# EasyEDA Pro project ProProject_称重电路的放大_2024-03-14.epro

# Schematic Schematic1
Create Date: 2024-03-13; Page Name: P1; Project Name: 称重电路的放大; Schematic Name: Schematic1; Update Date: 2024-03-14; Company: 嘉立创EDA; Page Size: A4; Version: V1.0
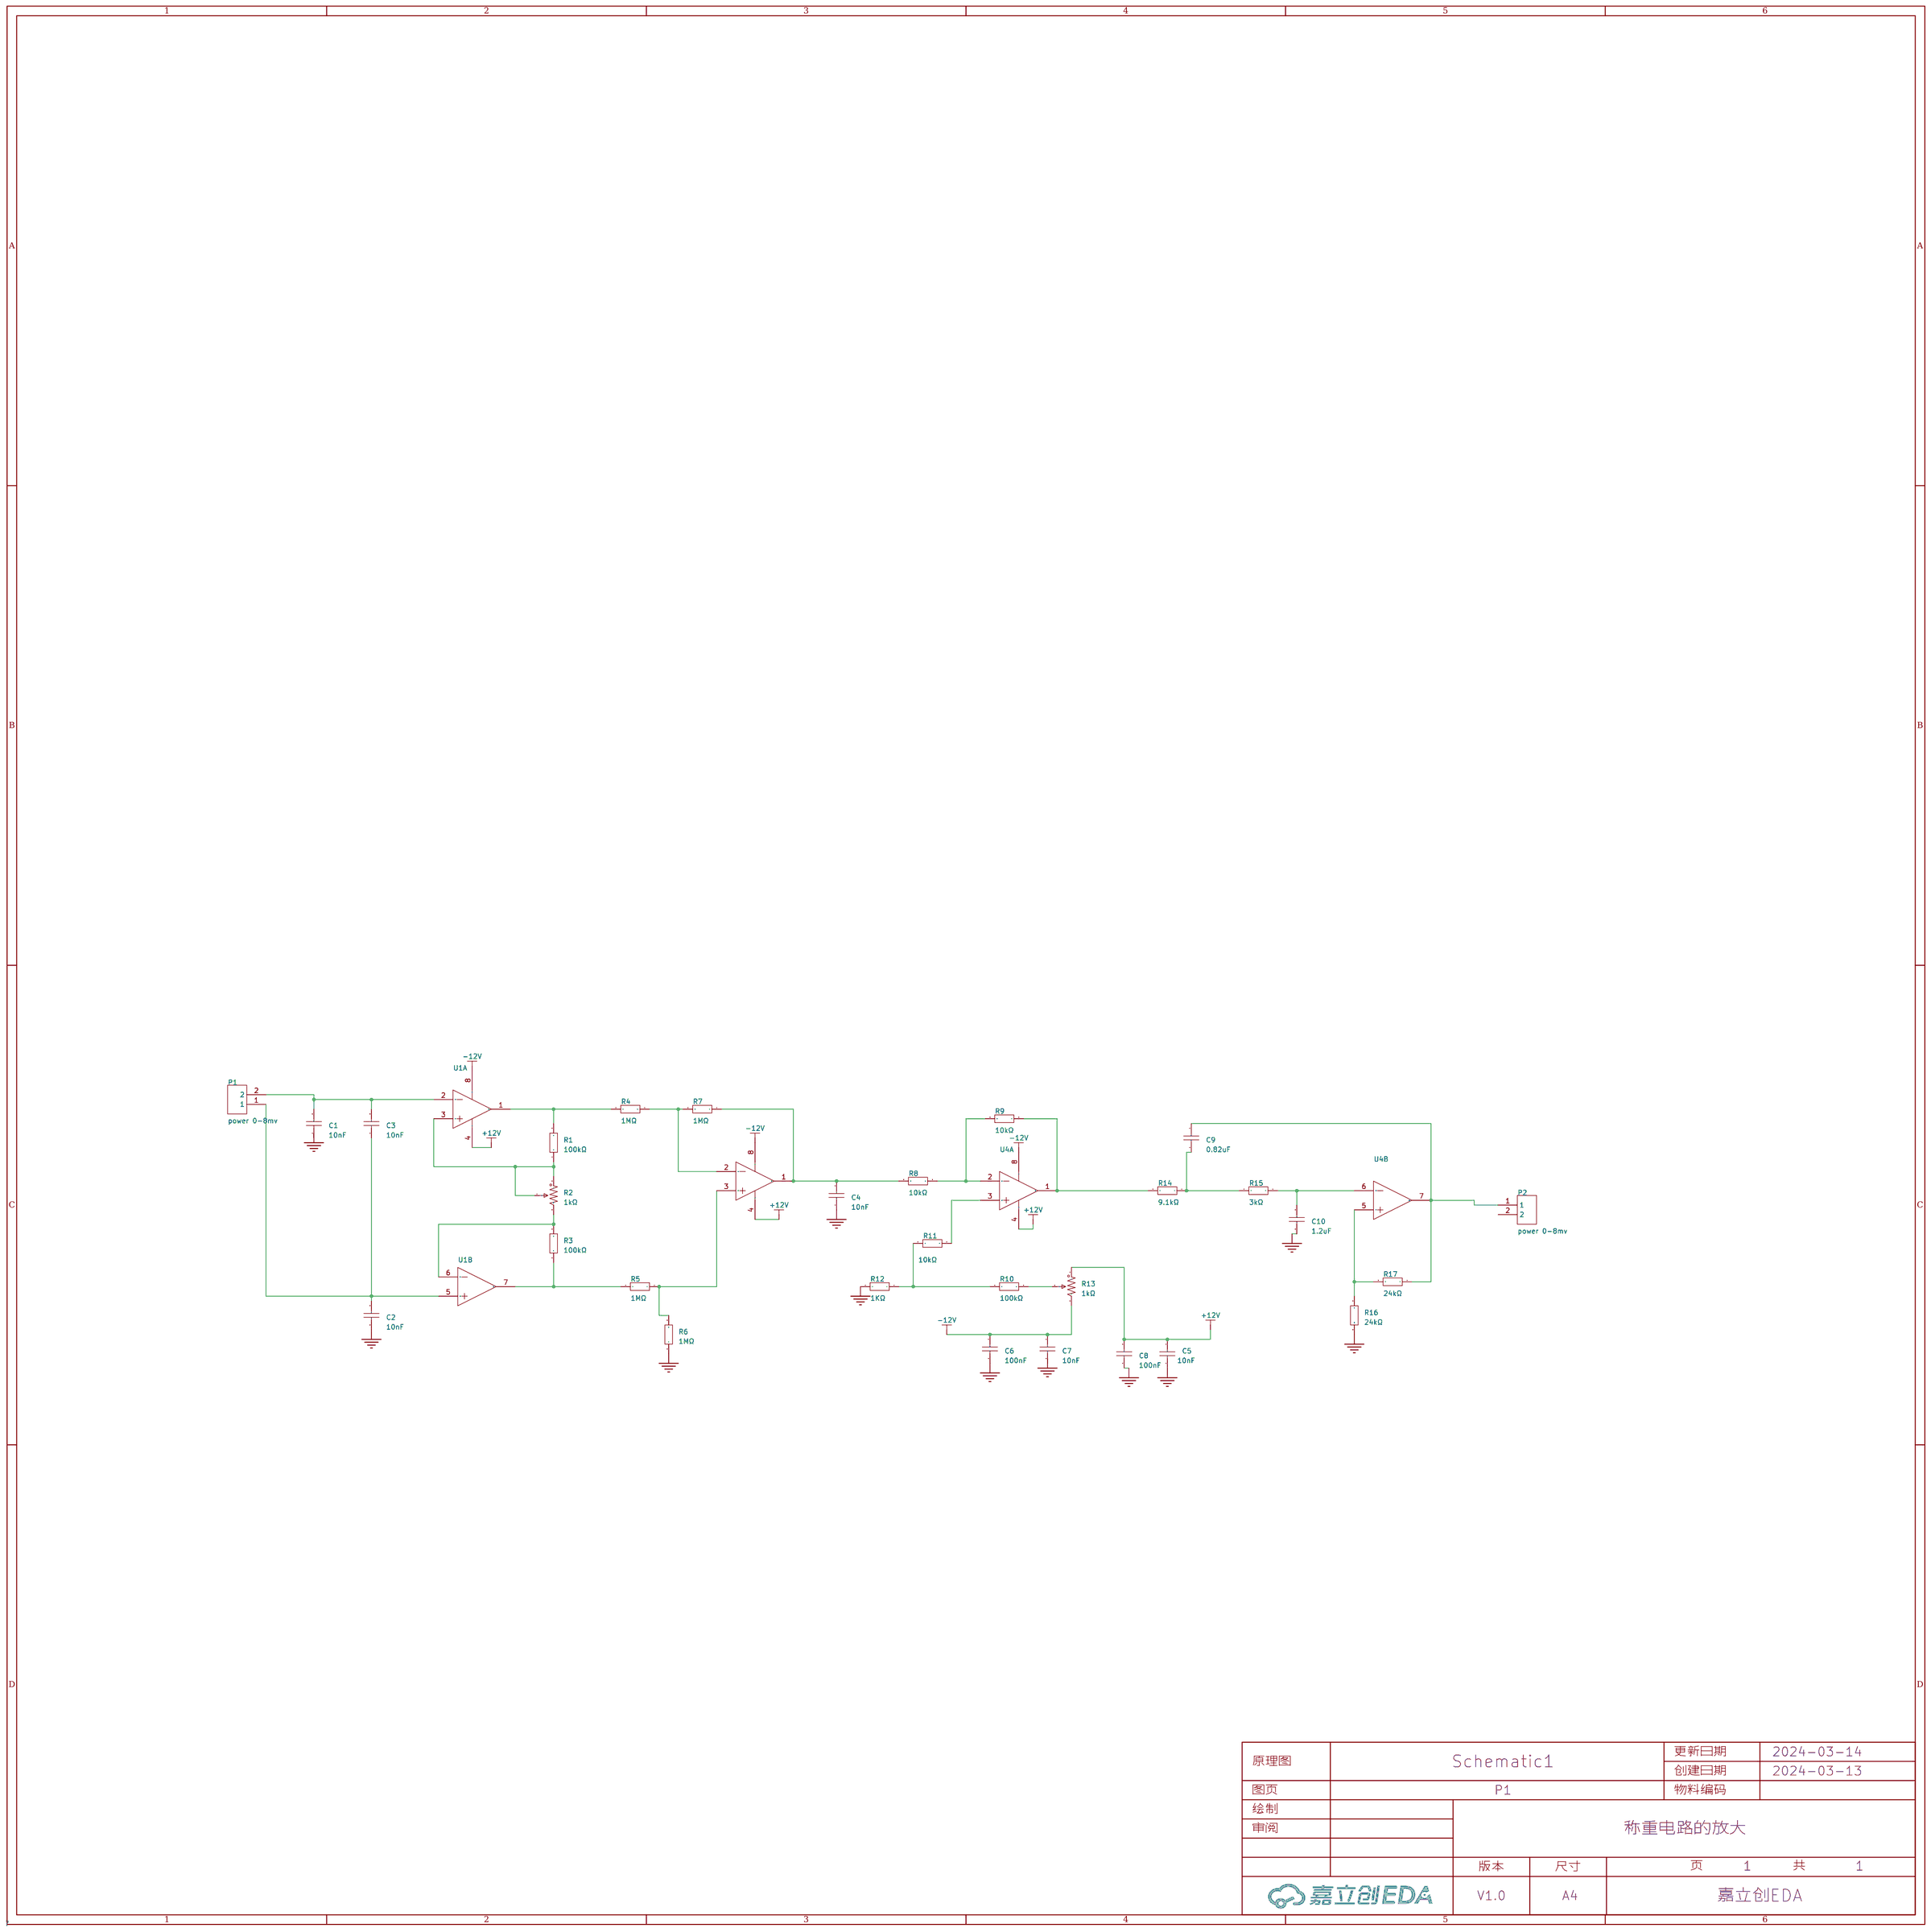
[diagram p0: schematic sheet]

## Parts
C1  10nF  [C0603]
C2  10nF  [C0603]
C3  10nF  [C0603]
C4  10nF  [C0603]
C5  10nF  [C0603]
C6  100nF  [C0603]
C7  10nF  [C0603]
C8  100nF  [C0603]
C9  0.82uF  [C0603]
C10  1.2uF  [C0603]
P1  power 0-8mv  [CONN-TH_2P-P5.00_WJ500V-5.08-2P]
P2  power 0-8mv  [CONN-TH_2P-P5.00_WJ500V-5.08-2P]
R1  100kΩ  [R0603]
R2  1kΩ  [RES-ADJ-TH_3362P]
R3  100kΩ  [R0603]
R4  1MΩ  [R0603]
R5  1MΩ  [R0603]
R6  1MΩ  [R0603]
R7  1MΩ  [R0603]
R8  10kΩ  [R0603]
R9  10kΩ  [R0603]
R10  100kΩ  [R0603]
R11  10kΩ  [R0603]
R12  1KΩ  [R0603]
R13  1kΩ  [RES-ADJ-TH_3362P]
R14  9.1kΩ  [R0603]
R15  3kΩ  [R0603]
R16  24kΩ  [R0603]
R17  24kΩ  [R0603]
U1  LM358N  [PDIP-8_L9.3-W6.4-P2.54-LS7.9-BL-1]  (sections 1,2)
U3  LM358N  [PDIP-8_L9.3-W6.4-P2.54-LS7.9-BL-1]  (section 1)
U4  LM358N  [PDIP-8_L9.3-W6.4-P2.54-LS7.9-BL-1]  (sections 1,2)

## Library data of the parts
C1-C10 = 0603B104K500NT: 容值:100nF;精度:±10%;额定电压:50V;材质(温度系数):X7R;; LCSC Part Name: 100nF ±10% 50V; Supplier Part: C30926; Manufacturer: FH(风华); Supplier Footprint: 0603; JLCPCB Part Class: 扩展库; Datasheet: https://atta.szlcsc.com/upload/public/pdf/source/20200305/C486355_26A10D38EF8C2A5C37091D0039909270.pdf; Supplier: LCSC; Tolerance: ±10%; Voltage Rated: 50V; Temperature Coefficient: X7R
P1 P2 = WJ500V-5.08-2P: 结构:1x2P;间距:5.08mm;颜色:绿色;安装方式:直插;额定电流:18A;额定电压:250V;排数:1;线规 - AWG:14~30;线规 - 平方毫米:2.5;每排PIN数:2;工作温度范围:-40℃~+105℃;; LCSC Part Name: 5.08mm 1x2P 排数:1 每排P数:2 直插; Supplier Part: C8465; Manufacturer: KANGNEX(康奈克斯电气); Supplier Footprint: 插件,P=5.08mm; JLCPCB Part Class: 扩展库; Datasheet: https://atta.szlcsc.com/upload/public/pdf/source/20191225/C8465_02D34CE5B5B4A53DF5891601D97FA9F4.pdf; Supplier: LCSC; Structure: 1x2P; Pitch: 5.08mm; Color: 绿色; Mounting Style: 直插; Current Rating (Max): 18A; Voltage Rating (Max): 250V; Number of Pins: 2P; Number of Rows: 1; Wire Gauge - AWG: 14~30; Wire Gauge - mm2: 2.5; Number of PINs Per Row: 2; Operating Temperature Range: -40℃~+105℃
R1 R3-R12 R14-R17 = 0603WAF1002T5E: 电阻类型:厚膜电阻;阻值:10kΩ;精度:±1%;功率:100mW;最大工作电压:75V;温度系数:±100ppm/℃;; LCSC Part Name: 厚膜电阻 10kΩ ±1% 100mW; Supplier Part: C25804; Manufacturer: UNI-ROYAL(厚声); Supplier Footprint: 0603; JLCPCB Part Class: 基础库; Datasheet: https://atta.szlcsc.com/upload/public/pdf/source/20200306/C422600_1E6D84923E4A46A82E41ADD87F860B5C.pdf; Supplier: LCSC; Type: 厚膜电阻; Tolerance: ±1%; Power(Watts): 100mW; Overload Voltage (Max): 75V; Temperature Coefficient: ±100ppm/℃; Operating Temperature Range: -55℃~+155℃
R2 R13 = 3362P-1-103: 阻值:10kΩ;精度:±10%;; LCSC Part Name: 10kΩ ±10%; Supplier Part: C118956; Manufacturer: BOCHEN(博晨); Supplier Footprint: 插件; JLCPCB Part Class: 扩展库; Datasheet: https://atta.szlcsc.com/upload/public/pdf/source/20171114/C118956_15106326650691117445.pdf; Supplier: LCSC; Tolerance: ±10%
U1 U3 U4 = LM358N_C4366086: Supplier Part: C4366086; Manufacturer: XICOR; Supplier Footprint: DIP-8; JLCPCB Part Class: 扩展库; Supplier: LCSC

## Nets
+12V: C5.2 C8.2 R13.1 U1.4(V-) U3.4(V-) U4.4(V-)
-12V: C6.2 C7.2 R13.3 U1.8(V+) U3.8(V+) U4.8(V+)
GND: C1.1 C2.1 C4.1 C5.1 C6.1 C7.1 C8.1 C10.1 R6.1 R12.2 R16.2
$1N397: C1.2 C3.2 P1.2 U1.2(IN A-)
$1N696: R1.1 R2.1 R2.2 U1.3(IN A+)
$1N759: R2.3 R3.2 U1.6(IN B-)
$1N767: C2.2 C3.1 P1.1 U1.5(IN B+)
$1N904: R1.2 R4.2 U1.1(OUT A)
$1N909: R3.1 R5.2 U1.7(OUT B)
$1N3920: R5.1 R6.2 U3.3(IN A+)
$1N3941: R4.1 R7.2 U3.2(IN A-)
$1N3981: C4.2 R7.1 R8.2 U3.1(OUT A)
$1N3996: R8.1 R9.2 U4.2(IN A-)
$1N4013: R11.1 U4.3(IN A+)
$1N4025: R10.2 R11.2 R12.1
$1N4050: R10.1 R13.2
$1N4316: R9.1 R14.2 U4.1(OUT A)
$1N4347: C9.1 R14.1 R15.2
$1N4360: C10.2 R15.1 U4.6(IN B-)
$1N4369: R16.1 R17.2 U4.5(IN B+)
$1N4410: C9.2 P2.1 R17.1 U4.7(OUT B)

Not connected (* = marked no-connect by the designer): P2 2

# Board PCB1
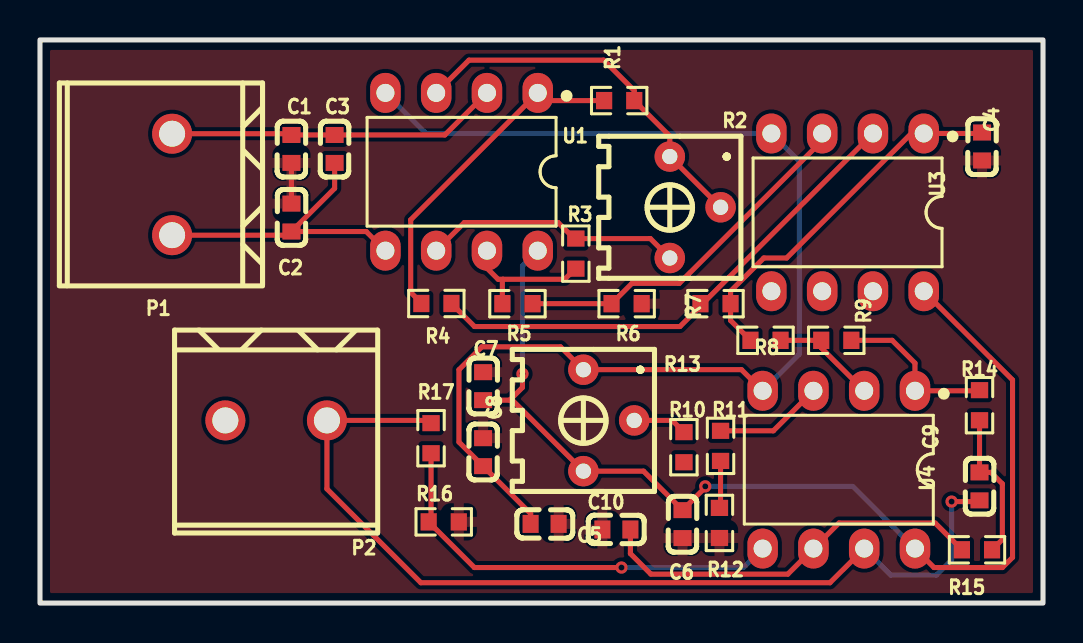
[diagram p1: board, top side]
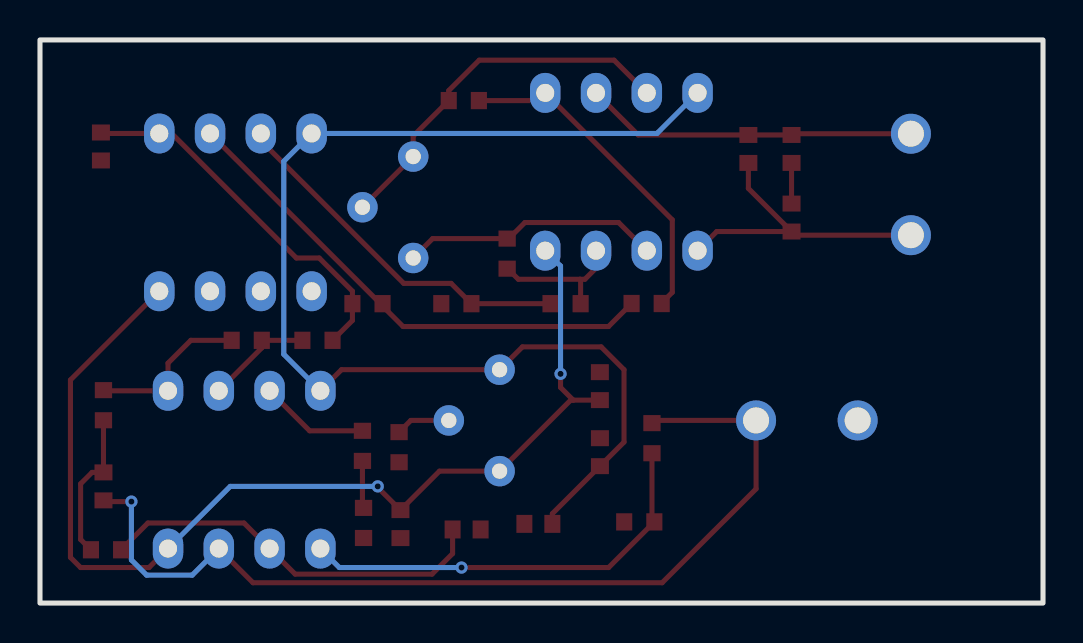
[diagram p2: board, bottom side, seen from below]

Outline 50.16 x 28.19 mm; copper layers: Top Layer, Bottom Layer. Coordinates in mm from the lower left corner of the outline.
Outline path: rectangle 0,28.19 50.16,0
Stack: Top Layer 0.035mm / Dielectric1 1.51mm FR4 er 4.5 / Bottom Layer 0.035mm

## Design rules (mm)
template: JLCPCB Capability(Two Layers Board)
spacing copperThickness1oz (default): track to track 0.102, other pairs 0.152 to 0.3
spacing copperThickness2oz: track to track 0.203, other pairs 0.152 to 0.3
track width copperThickness1oz (default): min 0.127, default 0.254, max 2.54
track width copperThickness2oz: min 0.203, default 0.254, max 2.54
differential pair differentialPair (default): width min 0.127, default 0.254, max 2.54; gap min 0.152, default 0.152
via viaSize (default): diameter min 0.5, default 0.61, max 10; hole min 0.3, default 0.305, max 6.3

## Placement (name value [footprint] x y rotation side)
C1  10nF  [C0603]  12.58 22.74 90 top
C2  10nF  [C0603]  12.58 19.3 270 top
C3  10nF  [C0603]  14.74 22.74 90 top
C4  10nF  [C0603]  47.12 22.86 90 top
C5  10nF  [C0603]  25.24 3.96 180 top
C6  100nF  [C0603]  32.14 3.95 90 top
C7  10nF  [C0603]  22.16 10.86 270 top
C8  100nF  [C0603]  22.16 7.55 270 top
C9  0.82uF  [C0603]  46.99 5.84 270 top
C10  1.2uF  [C0603]  28.83 3.68 0 top
P1  power 0-8mv  [CONN-TH_2P-P5.00_WJ500V-5.08-2P]  6.61 20.96 90 top
P2  power 0-8mv  [CONN-TH_2P-P5.00_WJ500V-5.08-2P]  11.81 9.14 180 top
R1  100kΩ  [R0603]  28.97 25.16 180 top
R2  1kΩ  [RES-ADJ-TH_3362P]  32.77 19.82 270 top
R3  100kΩ  [R0603]  26.8 17.49 90 top
R4  1MΩ  [R0603]  19.82 15 180 top
R5  1MΩ  [R0603]  23.88 14.99 180 top
R6  1MΩ  [R0603]  29.34 14.99 180 top
R7  1MΩ  [R0603]  33.79 14.99 180 top
R8  10kΩ  [R0603]  36.29 13.16 180 top
R9  10kΩ  [R0603]  39.83 13.16 180 top
R10  100kΩ  [R0603]  32.21 7.8 270 top
R11  10kΩ  [R0603]  34.04 7.87 270 top
R12  1KΩ  [R0603]  33.98 4.01 270 top
R13  1kΩ  [RES-ADJ-TH_3362P]  28.45 9.14 270 top
R14  9.1kΩ  [R0603]  46.99 9.91 90 top
R15  3kΩ  [R0603]  46.86 2.67 0 top
R16  24kΩ  [R0603]  20.19 4.06 0 top
R17  24kΩ  [R0603]  19.56 8.25 270 top
U1  LM358N  [PDIP-8_L9.3-W6.4-P2.54-LS7.9-BL-1]  21.09 21.59 180 top
U3  LM358N  [PDIP-8_L9.3-W6.4-P2.54-LS7.9-BL-1]  40.39 19.56 180 top
U4  LM358N  [PDIP-8_L9.3-W6.4-P2.54-LS7.9-BL-1]  39.95 6.68 180 top

## Footprints (pads in the part's own frame, mm; a bottom-side part is the same pattern mirrored in y, then rotated)
C0603
  rect 0.8x0.9 smd: 1(-0.7,0) 2(0.7,0)
CONN-TH_2P-P5.00_WJ500V-5.08-2P
  round 2 hole 1.3: 1(-2.54,0) 2(2.54,0)
PDIP-8_L9.3-W6.4-P2.54-LS7.9-BL-1
  oval 1.524x2 hole 0.9: 1(-3.81,-3.95) 2(-1.27,-3.95) 3(1.27,-3.95) 4(3.81,-3.95) 5(3.81,3.95) 6(1.27,3.95) 7(-1.27,3.95) 8(-3.81,3.95)
R0603
  rect 0.806x0.864 smd: 1(-0.753,0) 2(0.753,0)
RES-ADJ-TH_3362P
  round 1.524 hole 0.762: 1(-2.54,-1.27) 2(0,1.27) 3(2.54,-1.27)

## Nets
As in the schematic.

Pads without a net: P2 2; U3 5 6 7

## Via types
v1: diameter 0.61, hole 0.305, Top Layer to Bottom Layer, 4 vias

## Routing (per net, layer and track width the routed paths; a pad name or vN(x,y) marks a point on that pad's centre or on a via; arc(x,y) is an arc through that point)
+12V: length 60.1
  Top Layer w0.254: C5.2 24.54,4.48 C8.2 20.96,8.06 20.96,11.68 22.1,12.83 26.03,12.83 R13.1 35.09,11.68 U4.4
  Bottom Layer w0.254: U1.4 19.31,23.51 U3.4 37.97,22.12 37.97,12.46 U4.4
-12V: length 54.3
  Top Layer w0.254: U4.8 44.71,1.78 48.13,1.78 48.64,2.29 48.64,11.17 U3.8 ; 23.5,10.16 23.62,10.16 R13.3 30.19,6.6 C6.2 33.27,5.79 v1(33.27,5.84) ; 23.5,10.16 C7.2 ; 23.5,10.16 24.13,10.8 v1(24.13,11.47)
  Bottom Layer w0.254: v1(33.27,5.84) 40.65,5.84 U4.8 ; U1.8 24.13,16.88 24.13,11.56
GND: length 2
  Top Layer w0.254: C2.1 C1.1
$1N397: length 16.6
  Top Layer w0.254: P1.2 12.51,23.5 C1.2 C3.2 20.25,23.44 U1.2
$1N696: length 18.8
  Top Layer w0.254: U1.3 21.45,27.18 28.2,27.18 29.72,25.66 R1.1 31.5,23.38 R2.1 R2.2
$1N759: length 13
  Top Layer w0.254: U1.6 21.23,19.05 25.91,19.05 26.72,18.25 R3.2 30.53,18.25 R2.3
$1N767: length 15.5
  Top Layer w0.254: 12.58,18.73 12.27,18.42 P1.1 ; U1.5 16.32,18.6 C2.2 14.74,20.76 C3.1
$1N904: length 16.9
  Top Layer w0.254: R1.2 25.28,25.16 U1.1 18.54,19.19 18.54,15.56 19.07,15.03 R4.2
$1N909: length 7
  Top Layer w0.254: R3.1 26.77,16.74 26.24,16.21 23.16,16.21 ; U1.7 22.36,16.77 22.91,16.21 23.16,16.21 ; 23.16,16.21 23.13,16.18 R5.2
$1N3920: length 18.2
  Top Layer w0.254: U3.3 39.12,23.15 31.97,16.01 29.6,16.01 R6.2 R5.1
$1N3941: length 25.6
  Top Layer w0.254: R4.1 21.73,13.85 32.01,13.85 33.03,14.87 R7.2 33.14,14.99 U3.2
$1N3981: length 18.7
  Top Layer w0.254: R8.2 34.54,14.15 R7.1 34.54,15.62 36.2,17.28 37.34,17.28 43.58,23.51 U3.1 47.07,23.51 C4.2
$1N3996: length 5.4
  Top Layer w0.254: U4.2 39.07,12.78 R9.2 R8.1
$1N4013: length 5.5
  Top Layer w0.254: U4.3 36.68,8.62 R11.1
$1N4025: length 2.5
  Top Layer w0.254: R11.2 34.04,4.69 33.98,4.64
$1N4050: length 2.7
  Top Layer w0.254: R10.1 31.62,9.14 R13.2
$1N4316: length 8.3
  Top Layer w0.254: R14.2 46.96,10.63 U4.1 43.76,12.01 42.62,13.16 R9.1
$1N4347: length 7.5
  Top Layer w0.254: R14.1 C9.1 47.56,6.54 48.13,5.97 48.13,3.18 R15.2
$1N4360: length 19.8
  Top Layer w0.254: C10.2 29.53,2.47 30.56,1.45 37.4,1.45 U4.6 39.96,4.01 44.77,4.01 R15.1
$1N4369: length 21.5
  Top Layer w0.254: R17.2 19.56,4.18 R16.1 21.73,1.78 v1(29.08,1.78)
  Bottom Layer w0.254: U4.5 35.19,1.78 v1(29.08,1.78)
$1N4410: length 47.8
  Top Layer w0.254: v1(45.59,5.08) 46.93,5.08 C9.2 ; R17.1 19.42,9.14 P2.1 14.35,5.71 19.05,1.02 39.51,1.02 U4.7
  Bottom Layer w0.254: v1(45.59,5.08) 45.59,2.16 44.83,1.4 42.55,1.4 U4.7

## Copper pours and planes (outline as drawn; the poured copper is in the pictures)
GND on Top Layer: -2.16,31.11 56.26,31.11 56.26,-1.27 -2.16,-1.27

## Text on the board
Top Layer: 22030716陶岩
